# EAGLE design shield (EAGLE 6.6.0)

## Sheet 1 of 4
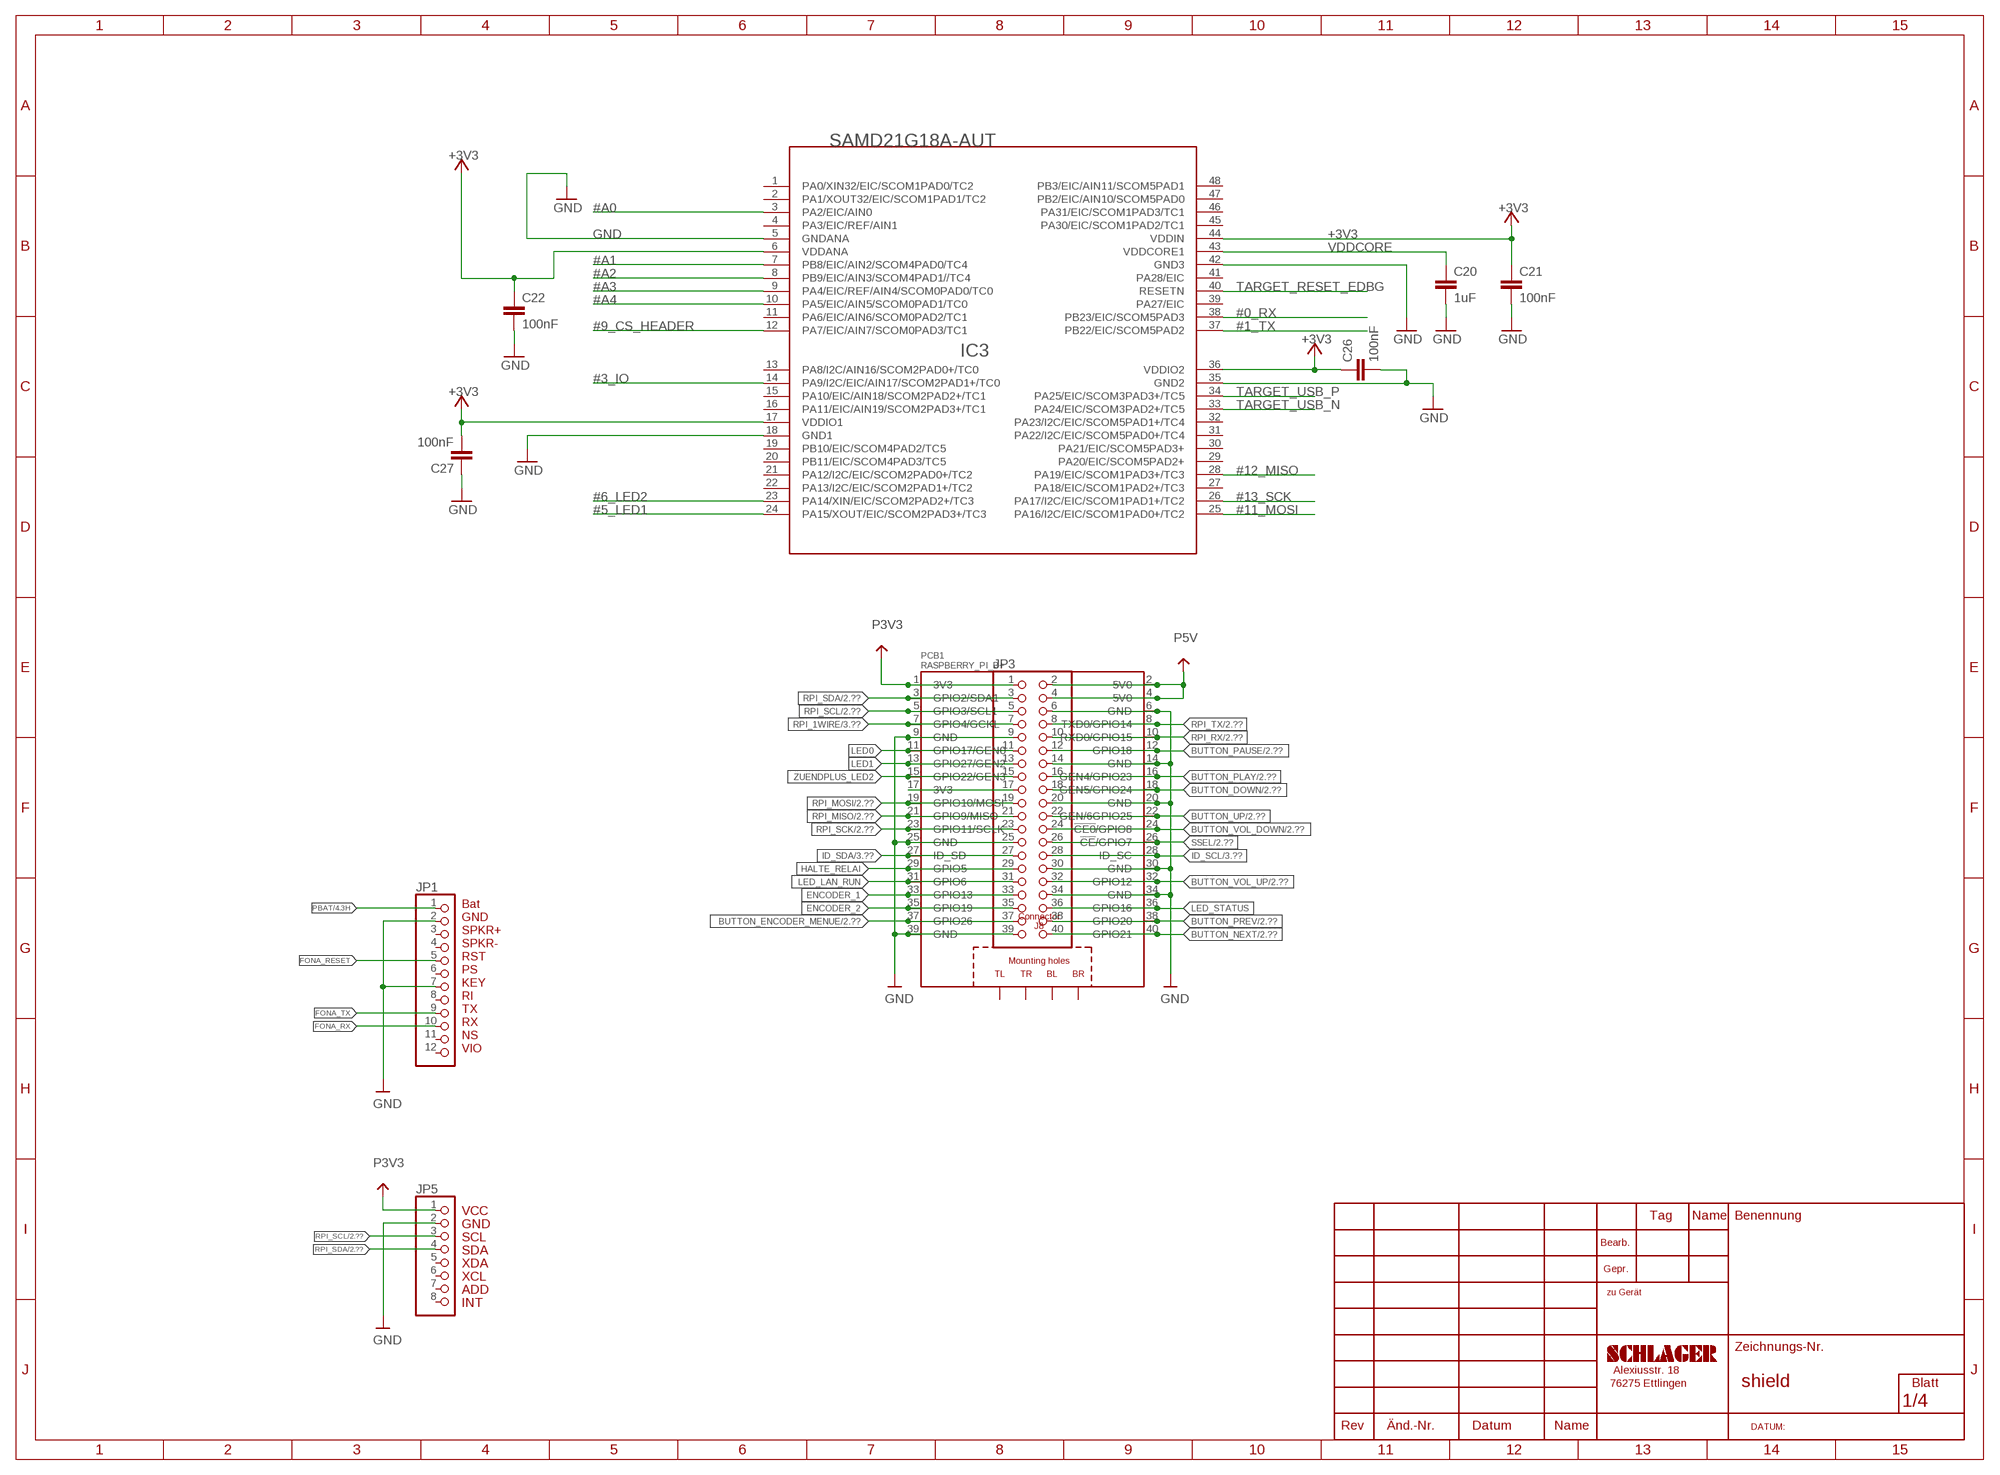
[diagram p0: schematic, sheet 1]

### Parts
C20  1uF  C-EUC0805  [C0805]
C21  100nF  C-EUC0805  [C0805]
C22  100nF  C-EUC0805  [C0805]
C26  100nF  C-EUC0805  [C0805]
C27  100nF  C-EUC0805  [C0805]
IC3  SAMD21G18A-AUT  1792_SAMD21G18A-AUT  [TQFP48-7X7]
JP1  ADAFRUIT-FONA  [ADAFRUITFONA]
JP3  PINHD-2X20  [2X20]
JP5  GY-521  [GY-521]
PCB1  RASPBERRY_PI_B+  [RASPBERRY_PI_B+]

### Nets
3V3@2: JP3.17 PCB1.17(3V3)
#0_RX: IC3.38(PB23/EIC/SCOM5PAD3)
#1_TX: IC3.37(PB22/EIC/SCOM5PAD2)
#3_IO: IC3.14(PA9/I2C/EIC/AIN17/SCOM2PAD1+/TC0)
#5_LED1: IC3.24(PA15/XOUT/EIC/SCOM2PAD3+/TC3)
#6_LED2: IC3.23(PA14/XIN/EIC/SCOM2PAD2+/TC3)
#9_CS_HEADER: IC3.12(PA7/EIC/AIN7/SCOM0PAD3/TC1)
#11_MOSI: IC3.25(PA16/I2C/EIC/SCOM1PAD0+/TC2)
#12_MISO: IC3.28(PA19/EIC/SCOM1PAD3+/TC3)
#13_SCK: IC3.26(PA17/I2C/EIC/SCOM1PAD1+/TC2)
#A0: IC3.3(PA2/EIC/AIN0)
#A1: IC3.7(PB8/EIC/AIN2/SCOM4PAD0/TC4)
#A2: IC3.8(PB9/EIC/AIN3/SCOM4PAD1//TC4)
#A3: IC3.9(PA4/EIC/REF/AIN4/SCOM0PAD0/TC0)
#A4: IC3.10(PA5/EIC/AIN5/SCOM0PAD1/TC0)
+3V3: C21.1 C22.1 C26.1 C27.2 IC3.6(VDDANA) IC3.17(VDDIO1) IC3.36(VDDIO2) IC3.44(VDDIN) ; also sheet 4
BUTTON_DOWN: JP3.18 PCB1.18(GEN5/GPIO24) ; also sheet 2
BUTTON_ENCODER_MENUE: JP3.37 PCB1.37(GPIO26) ; also sheet 2
BUTTON_NEXT: JP3.40 PCB1.40(GPIO21) ; also sheet 2
BUTTON_PAUSE: JP3.12 PCB1.12(GPIO18) ; also sheet 2
BUTTON_PLAY: JP3.16 PCB1.16(GEN4/GPIO23) ; also sheet 2
BUTTON_PREV: JP3.38 PCB1.38(GPIO20) ; also sheet 2
BUTTON_UP: JP3.22 PCB1.22(GEN/6GPIO25) ; also sheet 2
BUTTON_VOL_DOWN: JP3.24 PCB1.24(!CE0!/GPIO8) ; also sheet 2
BUTTON_VOL_UP: JP3.32 PCB1.32(GPIO12) ; also sheet 2
ENCODER_1: JP3.33 PCB1.33(GPIO13)
ENCODER_2: JP3.35 PCB1.35(GPIO19)
FONA_RESET: JP1.5
FONA_RX: JP1.10
FONA_TX: JP1.9
GND: C20.2 C21.2 C22.2 C26.2 C27.1 IC3.5(GNDANA) IC3.18(GND1) IC3.35(GND2) IC3.42(GND3) JP1.2 JP1.7 JP3.6 JP3.14 JP3.20 JP3.30 JP3.34 JP5.2 PCB1.6(GND) PCB1.14(GND) PCB1.20(GND) PCB1.30(GND) PCB1.34(GND) ; also sheet 2,3,4
GND@1: JP3.9 JP3.25 JP3.39 PCB1.9(GND) PCB1.25(GND) PCB1.39(GND) ; supply symbol labelled GND
HALTE_RELAI: JP3.29 PCB1.29(GPIO5)
ID_SCL: JP3.28 PCB1.28(ID_SC) ; also sheet 3
ID_SDA: JP3.27 PCB1.27(ID_SD) ; also sheet 3
LED0: JP3.11 PCB1.11(GPIO17/GEN0)
LED1: JP3.13 PCB1.13(GPIO27/GEN2)
LED_LAN_RUN: JP3.31 PCB1.31(GPIO6)
LED_STATUS: JP3.36 PCB1.36(GPIO16)
P3V3: JP3.1 JP5.1 PCB1.1(3V3) ; also sheet 2,3,4
P5V: JP3.2 JP3.4 PCB1.2(5V0) PCB1.4(5V0) ; also sheet 3
PBAT: JP1.1 ; also sheet 4
RPI_1WIRE: JP3.7 PCB1.7(GPIO4/GCKL) ; also sheet 3
RPI_MISO: JP3.21 PCB1.21(GPIO9/MISO) ; also sheet 2
RPI_MOSI: JP3.19 PCB1.19(GPIO10/MOSI) ; also sheet 2
RPI_RX: JP3.10 PCB1.10(RXD0/GPIO15) ; also sheet 2
RPI_SCK: JP3.23 PCB1.23(GPIO11/SCLK) ; also sheet 2
RPI_SCL: JP3.5 JP5.3 PCB1.5(GPIO3/SCL1) ; also sheet 2,3
RPI_SDA: JP3.3 JP5.4 PCB1.3(GPIO2/SDA1) ; also sheet 2,3
RPI_TX: JP3.8 PCB1.8(TXD0/GPIO14) ; also sheet 2
SSEL: JP3.26 PCB1.26(!CE!/GPIO7) ; also sheet 2
TARGET_RESET_EDBG: IC3.40(RESETN)
TARGET_USB_N [USBpair]: IC3.33(PA24/EIC/SCOM3PAD2+/TC5) ; also sheet 2
TARGET_USB_P [USBpair]: IC3.34(PA25/EIC/SCOM3PAD3+/TC5) ; also sheet 2
VDDCORE: C20.1 IC3.43(VDDCORE1)
ZUENDPLUS_LED2: JP3.15 PCB1.15(GPIO22/GEN3)
Unconnected: IC3.1(PA0/XIN32/EIC/SCOM1PAD0/TC2) IC3.2(PA1/XOUT32/EIC/SCOM1PAD1/TC2) IC3.4(PA3/EIC/REF/AIN1) IC3.11(PA6/EIC/AIN6/SCOM0PAD2/TC1) IC3.13(PA8/I2C/AIN16/SCOM2PAD0+/TC0) IC3.15(PA10/EIC/AIN18/SCOM2PAD2+/TC1) IC3.16(PA11/EIC/AIN19/SCOM2PAD3+/TC1) IC3.19(PB10/EIC/SCOM4PAD2/TC5) IC3.20(PB11/EIC/SCOM4PAD3/TC5) IC3.21(PA12/I2C/EIC/SCOM2PAD0+/TC2) IC3.22(PA13/I2C/EIC/SCOM2PAD1+/TC2) IC3.27(PA18/EIC/SCOM1PAD2+/TC3) IC3.29(PA20/EIC/SCOM5PAD2+) IC3.30(PA21/EIC/SCOM5PAD3+) IC3.31(PA22/I2C/EIC/SCOM5PAD0+/TC4) IC3.32(PA23/I2C/EIC/SCOM5PAD1+/TC4) IC3.39(PA27/EIC) IC3.41(PA28/EIC) IC3.45(PA30/EIC/SCOM1PAD2/TC1) IC3.46(PA31/EIC/SCOM1PAD3/TC1) IC3.47(PB2/EIC/AIN10/SCOM5PAD0) IC3.48(PB3/EIC/AIN11/SCOM5PAD1) JP1.3 JP1.4 JP1.6 JP1.8 JP1.11 JP1.12 JP5.5 JP5.6 JP5.7 JP5.8 PCB1.PE_BL(BL) PCB1.PE_BR(BR) PCB1.PE_TL(TL) PCB1.PE_TR(TR)

## Sheet 2 of 4
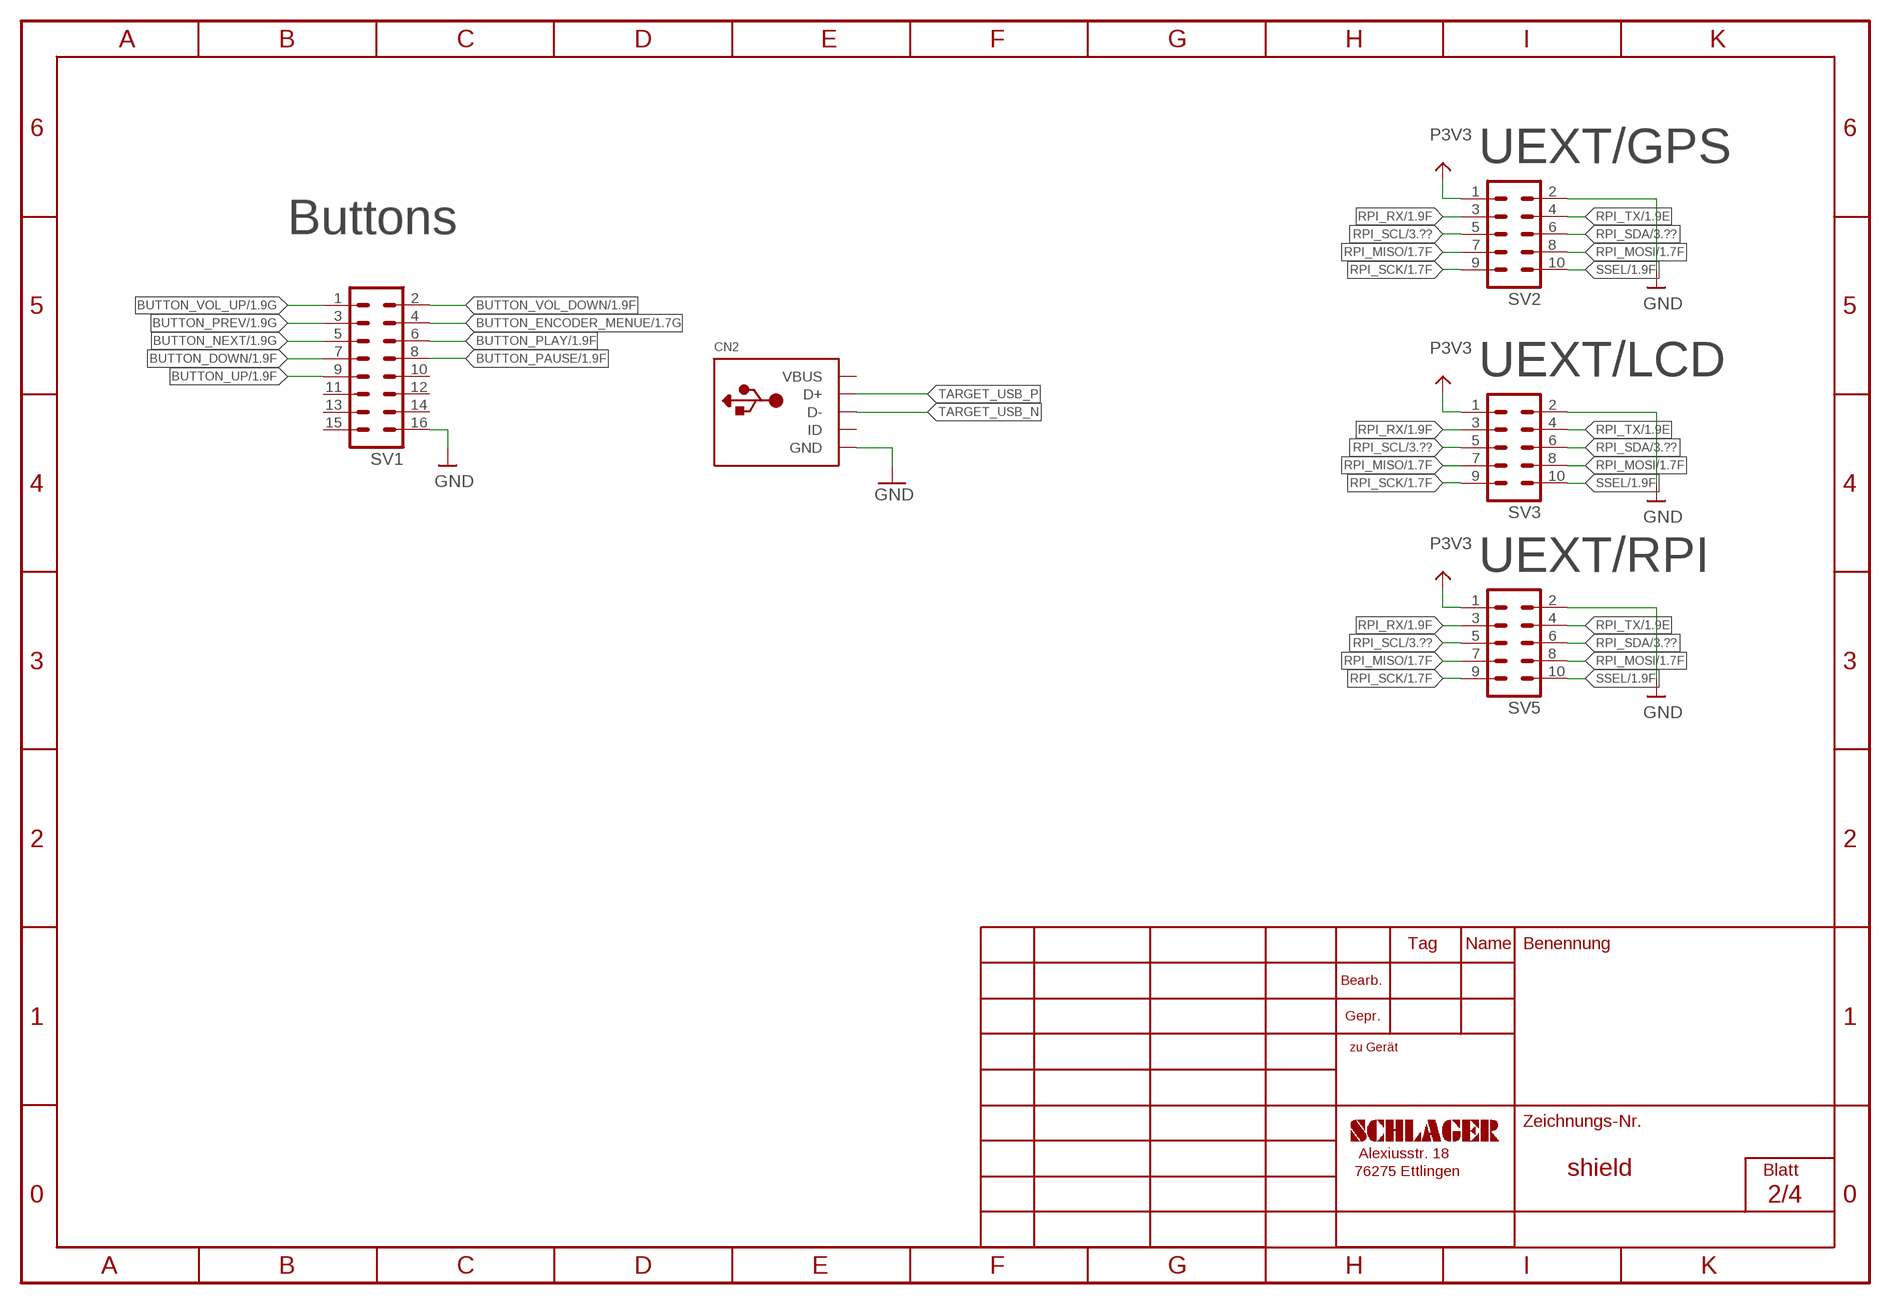
[diagram p1: schematic, sheet 2]

### Parts
CN2  USBMINIB  [USB-MINIB]
SV1  ML16  [ML16]
SV2  ML10  [ML10]
SV3  ML10  [ML10]
SV5  ML10  [ML10]

### Nets
BUTTON_DOWN: SV1.7 ; also sheet 1
BUTTON_ENCODER_MENUE: SV1.4 ; also sheet 1
BUTTON_NEXT: SV1.5 ; also sheet 1
BUTTON_PAUSE: SV1.8 ; also sheet 1
BUTTON_PLAY: SV1.6 ; also sheet 1
BUTTON_PREV: SV1.3 ; also sheet 1
BUTTON_UP: SV1.9 ; also sheet 1
BUTTON_VOL_DOWN: SV1.2 ; also sheet 1
BUTTON_VOL_UP: SV1.1 ; also sheet 1
GND: CN2.GND SV1.16 SV2.2 SV3.2 SV5.2 ; also sheet 1,3,4
P3V3: SV2.1 SV3.1 SV5.1 ; also sheet 1,3,4
RPI_MISO: SV2.7 SV3.7 SV5.7 ; also sheet 1
RPI_MOSI: SV2.8 SV3.8 SV5.8 ; also sheet 1
RPI_RX: SV2.3 SV3.3 SV5.3 ; also sheet 1
RPI_SCK: SV2.9 SV3.9 SV5.9 ; also sheet 1
RPI_SCL: SV2.5 SV3.5 SV5.5 ; also sheet 1,3
RPI_SDA: SV2.6 SV3.6 SV5.6 ; also sheet 1,3
RPI_TX: SV2.4 SV3.4 SV5.4 ; also sheet 1
SSEL: SV2.10 SV3.10 SV5.10 ; also sheet 1
TARGET_USB_N [USBpair]: CN2.D- ; also sheet 1
TARGET_USB_P [USBpair]: CN2.D+ ; also sheet 1
Unconnected: CN2.ID SV1.10 SV1.11 SV1.12 SV1.13 SV1.14 SV1.15

### Notes on the sheet
- UEXT/GPS
- Buttons
- UEXT/LCD
- UEXT/RPI

## Sheet 3 of 4: 1wire
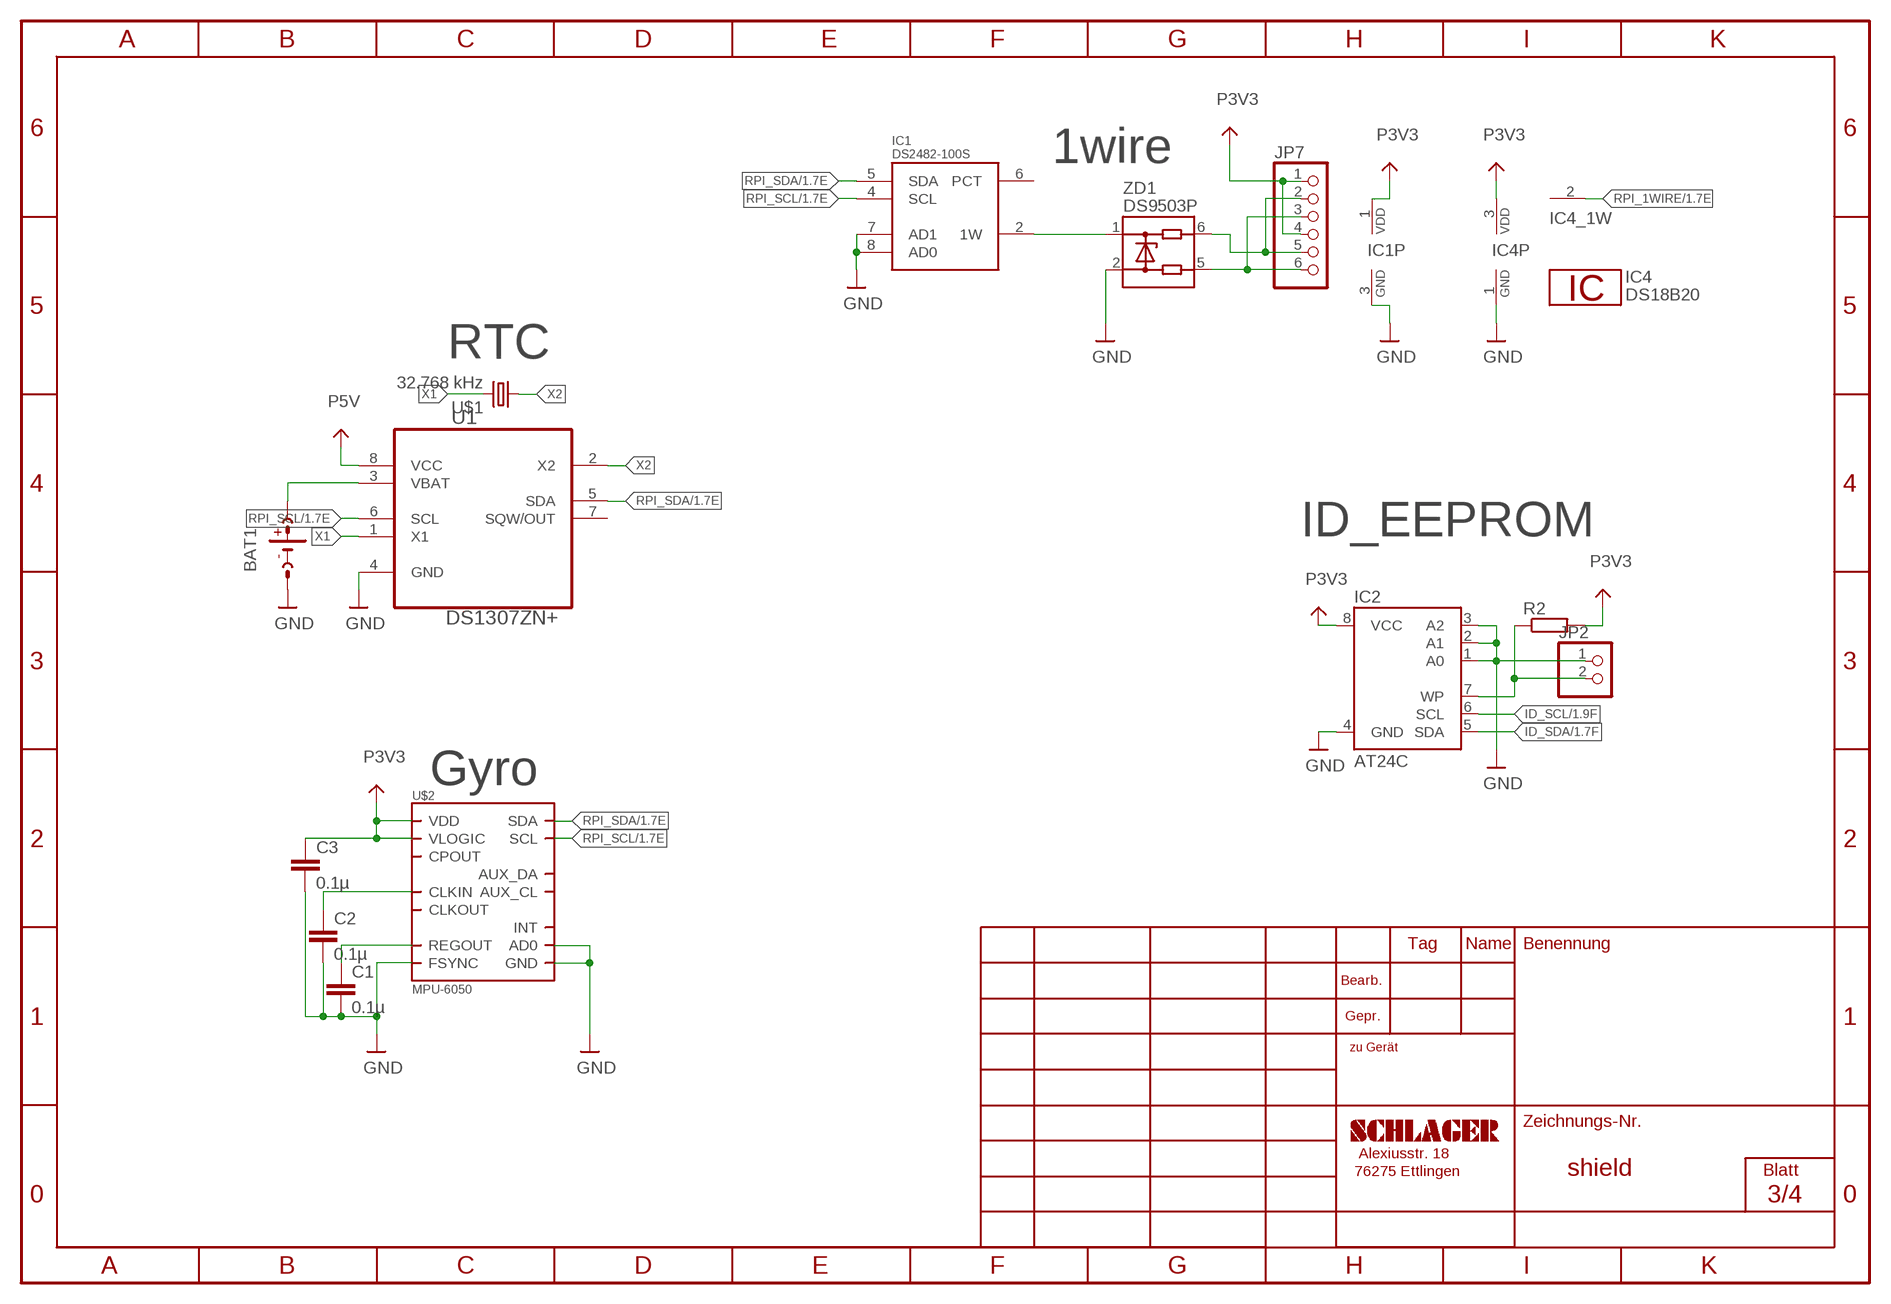
[diagram p2: schematic, sheet 3]

### Parts
BAT1  CR2032  [CR2032-SOCKET]
C1  0.1µ  C-EUC0805  [C0805]
C2  0.1µ  C-EUC0805  [C0805]
C3  0.1µ  C-EUC0805  [C0805]
IC1  DS2482-100S  [SO08]
IC2  AT24C  [SO08]
IC4  DS18B20  [TO92-]
JP2  PINHD-1X2  [1X02]
JP7  PINHD-1X6/90  [1X06/90]
R2  R-EU_R0805  [R0805]
U1  DS1307ZN+  [SOIC127P600X175-8N]
U$1  32.768 kHz  CC5V-12,5  [CC5]
U$2  MPU-6050  [QFN.24.4X4]
ZD1  DS9503P  [TSOC6]

### Nets
GND: BAT1.M(NEG) C1.2 C2.2 C3.2 IC1.3(GND) IC1.7(AD1) IC1.8(AD0) IC2.1(A0) IC2.2(A1) IC2.3(A2) IC2.4(GND) IC4.1 JP2.1 U1.4(GND) U$2.9(AD0) U$2.11(FSYNC) U$2.18(GND) ZD1.2 ; also sheet 1,2,4
ID_SCL: IC2.6(SCL) ; also sheet 1
ID_SDA: IC2.5(SDA) ; also sheet 1
N$1: BAT1.P(POS2) U1.3(VBAT)
N$2: JP7.3 JP7.6 ZD1.5
N$3: C1.1 U$2.10(REGOUT)
N$4: C2.1 U$2.1(CLKIN)
N$5: IC2.7(WP) JP2.2 R2.1
N$6: JP7.2 JP7.5 ZD1.6
N$10: IC1.2(1W) ZD1.1
P3V3: C3.1 IC1.1(VDD) IC2.8(VCC) IC4.3 JP7.1 JP7.4 R2.2 U$2.8(VLOGIC) U$2.13(VDD) ; also sheet 1,2,4
P5V: U1.8(VCC) ; also sheet 1
RPI_1WIRE: IC4.2 ; also sheet 1
RPI_SCL: IC1.4(SCL) U1.6(SCL) U$2.23(SCL) ; also sheet 1,2
RPI_SDA: IC1.5(SDA) U1.5(SDA) U$2.24(SDA) ; also sheet 1,2
X1: U1.1(X1) U$1.P$2
X2: U1.2(X2) U$1.P$1
Unconnected: IC1.6(PCT) U1.7(SQW/OUT) U$2.6(AUX_DA) U$2.7(AUX_CL) U$2.12(INT) U$2.20(CPOUT) U$2.22(CLKOUT)

### Notes on the sheet
- 1wire
- RTC
- ID_EEPROM
- Gyro

## Sheet 4 of 4
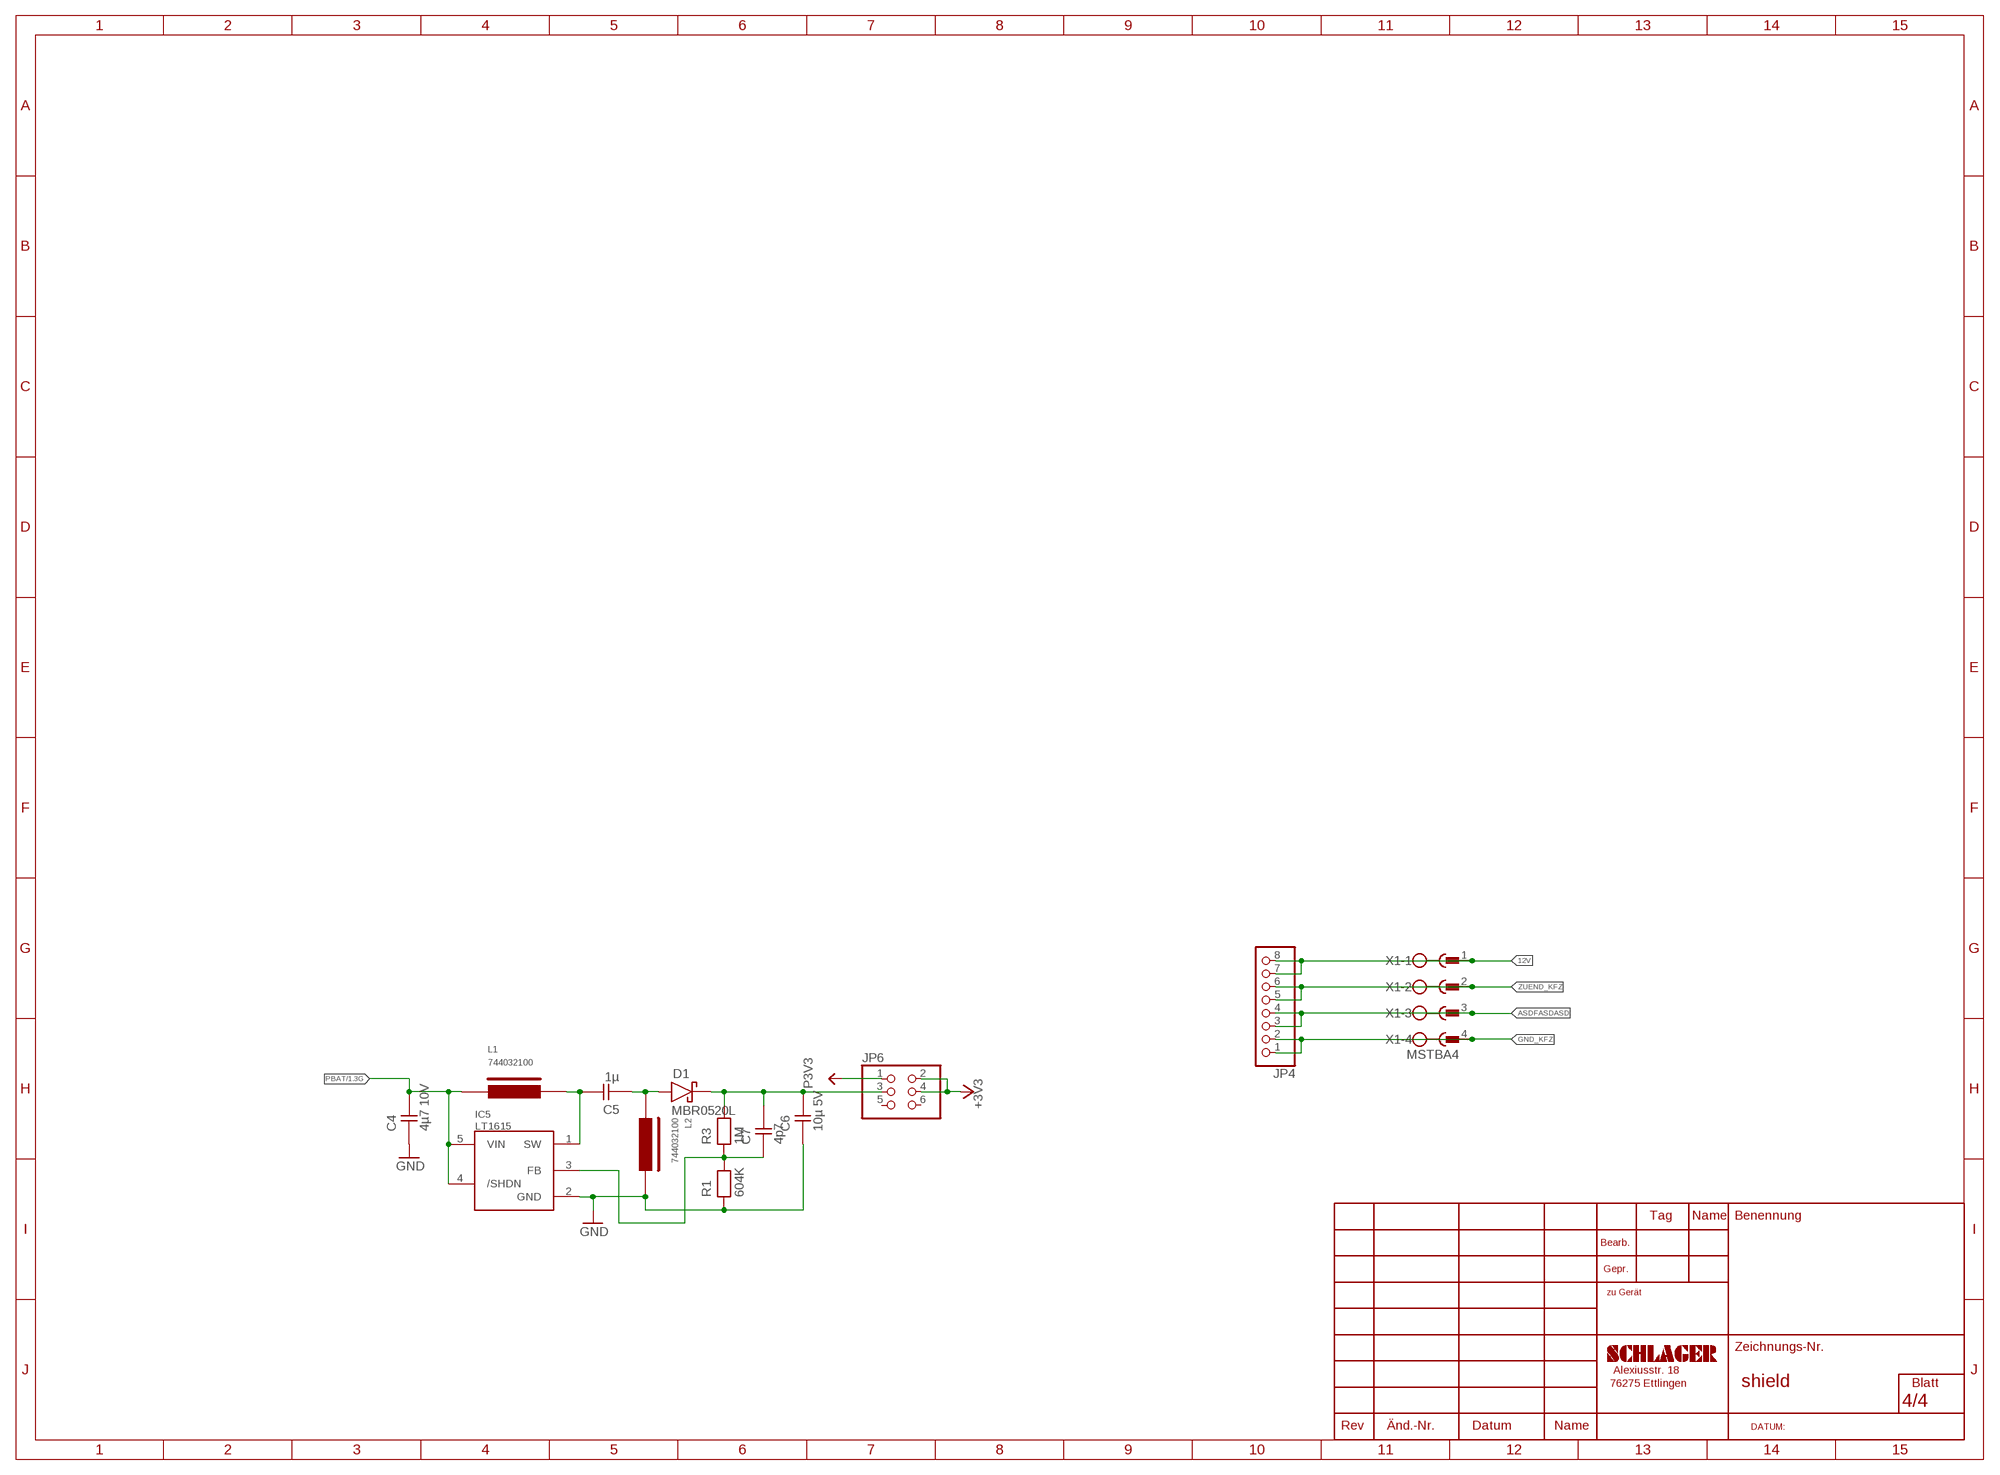
[diagram p3: schematic, sheet 4]

### Parts
C4  4µ7 10V  CAP0805  [0805]
C5  1µ  CAP0805  [0805]
C6  10µ 5V  CAP0805  [0805]
C7  4p7  CAP0603R  [0603REFLOW]
D1  MBR0520L  [SOD123]
IC5  LT1615  [SOT23-5]
JP4  PINHD-1X8/90  [1X08/90]
JP6  PINHD-2X3  [2X03]
L1  744032100  WE-LQ  [WE-LQ]
L2  744032100  WE-LQ  [WE-LQ]
R1  604K  RES0603R  [0603REFLOW]
R3  1M  RES0603R  [0603REFLOW]
X1  MSTBA4  [MSTBA4]

### Nets
12V: JP4.7 JP4.8 X1.1
+3V3: JP6.2 JP6.4 ; also sheet 1
ASDFASDASD: JP4.3 JP4.4 X1.3
GND: C4.1 C6.1 IC5.2(GND) L2.P$2 R1.1 ; also sheet 1,2,3
GND_KFZ: JP4.1 JP4.2 X1.4
N$7: C5.2 IC5.1(SW) L1.P$2
N$8: C5.1 D1.A L2.P$1
N$9: C6.2 C7.2 D1.K JP6.3 R3.2
N$16: C7.1 IC5.3(FB) R1.2 R3.1
P3V3: JP6.1 ; also sheet 1,2,3
PBAT: C4.2 IC5.4(/SHDN) IC5.5(VIN) L1.P$1 ; also sheet 1
ZUEND_KFZ: JP4.5 JP4.6 X1.2
Unconnected: JP6.5 JP6.6

## Power pins joined to a net without a drawn wire
VBUS: CN2.VBUS

## Library data of the parts
BAT1 = con_bat_2032__s_:CR2032
C1-C3 C20-C22 C26 C27 = schlager_passiv:C-EU: CAPACITOR, European symbol
C4-C6 = MYPASS:CAP0805
C7 = mypassive-bleifrei:CAP0603
CN2 = adafruit:USB: USB Connectors USBMINIB - Surface Mount Female Mini-B USB Connector 4UConnector: 06564 By microbuilder.eu Thru-hole RA Female Mini-B USB Connector 4UConnector: 18732 By ladyada.net
D1 = MYDISCR:MBR0520L
IC1 = 1wire:DS2482-100: I2C to 1-Wire Host Adapter/Line Driver This device is a onewire host and I2C interface in one chip. It provides the complete DC/AC requirements for onewire communication, including overdrive speed mode, but, unlike the DS2480B chip, no 12V EPROM programming. Notes: For overdrive speed and 5V EEPROM programming, an external active pullup circuit must be connected to the 1W, VDD and PCT pin. See the datasheet for details. The lower two I2C adress bits of the chip can be selected by external pins, so up to 4 chips may be connected to the same I2C bus. Author: Orginal device and description from Giovanni Varasano <giovanni.varasano@fastwebnet.it> Improved by Jan Kandziora <jjj@gmx.de>
IC2 = schlager_ics:AT24C*: 2-wire serial EEPROM
IC3 = IntegratedCircuits:1792_SAMD21G18A-AUT: Atmel D21 32bit ARM Cortex-M0 microcontroller - 48 PIN TQFP 256KB flash memory + 32KB SRAM
IC4 = 1wire:DS18B20: Programmable Resolution Digital Thermometer This chip provides a onewire thermosensor with approx. 0.5°C accuracy. A programmable over/undertemperure alarm is available. The precision can be set from 9..12 bits. Notes: Vdd must be applied for accurate measurements at low temperatures, as the parasite power circuit otherwise heats the sensor. If parasite power is used, Vdd has to be connected to GND. The DS1822 is a low-cost thermometer chip, the DS18S20 is similar to the DS18B20, but with 9 Bit precision only. Author: Jan Kandziora <jjj@gmx.de>
IC5 = MYLT:LT1615
JP1 = schlager_modules:ADAFRUIT-FONA: PIN HEADER
JP2 = pinhead:PINHD-1X2: PIN HEADER
JP3 = pinhead:PINHD-2X20: PIN HEADER
JP4 = pinhead:PINHD-1X8: PIN HEADER
JP5 = schlager_modules:GY-521: PIN HEADER
JP6 = pinhead:PINHD-2X3: PIN HEADER
JP7 = pinhead:PINHD-1X6: PIN HEADER
L1 L2 = myinductiv:WE-LQ
PCB1 = RASPBERRY_PI_Bplus:RASPBERRY_PI_B+: Raspberry Pi B+ Based on issue: Thursday, July 10, 2014 - Rev 1.2 LBR by Tim R. 07-2014
R1 R3 = mypassive-bleifrei:RES0603
R2 = schlager_passiv:R-EU_: RESISTOR, European symbol
SV1 = X_Pfostenstecker:ML16: HARTING; OC_FARNELL: unknown; OC_NEWARK: unknown
SV2 SV3 SV5 = X_Pfostenstecker:ML10: HARTING; OC_FARNELL: unknown; OC_NEWARK: unknown
U1 = schlager_ics:DS1307ZN+: 64 x 8, Serial, I2C Real-Time Clock; MPN: DS1307ZN+; OC_FARNELL: 9725253; OC_NEWARK: 96K8872; PACKAGE: SOIC-8; SUPPLIER: Maxim
U$1 = schlager_Quarze:CC5V; MPN: CC5V-T1A 32,768KHZ 12,5PF; OC_FARNELL: 1539374RL; OC_REICHELT: 32,768 CC5V-12,5
U$2 = invensense:MPU-6050
X1 = X_Phoenix:MSTBA4: PHOENIX
ZD1 = 1wire:DS9503: ESD Protection Diode with Resistors This ESD protection diode is designed especially for onewire host interfaces. Unlike the DS9502, it has two additional 5Ohm resitors in the 1W and GND line. Pin 5 and 6 have to be connected to the host side, pin 1 und 2 to the network side. The 1W line is through pin 1 and 6, the GND line is through pin 2 and 5. Author: Jan Kandziora <jjj@gmx.de>

## Net classes
4 USBpair: width 0.254 mm, drill 0.406 mm, clearance 0.508 mm

## Board
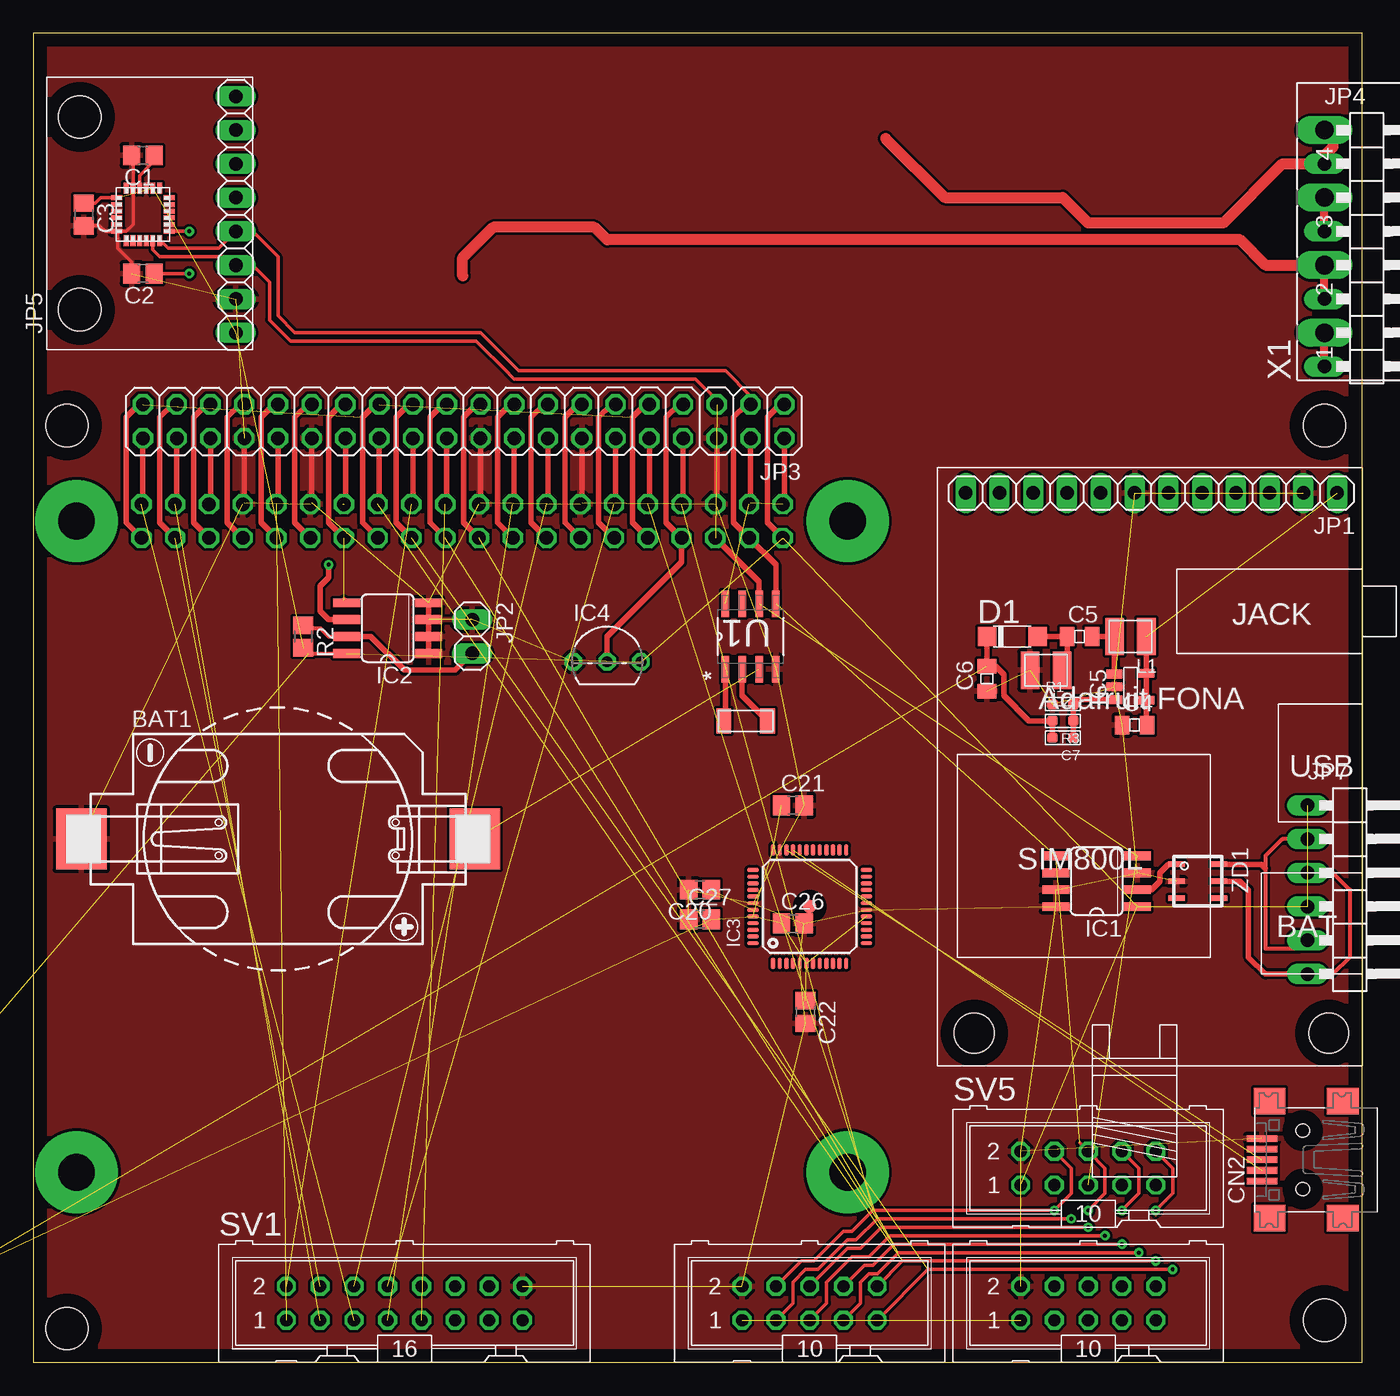
[diagram p4: board, top side]
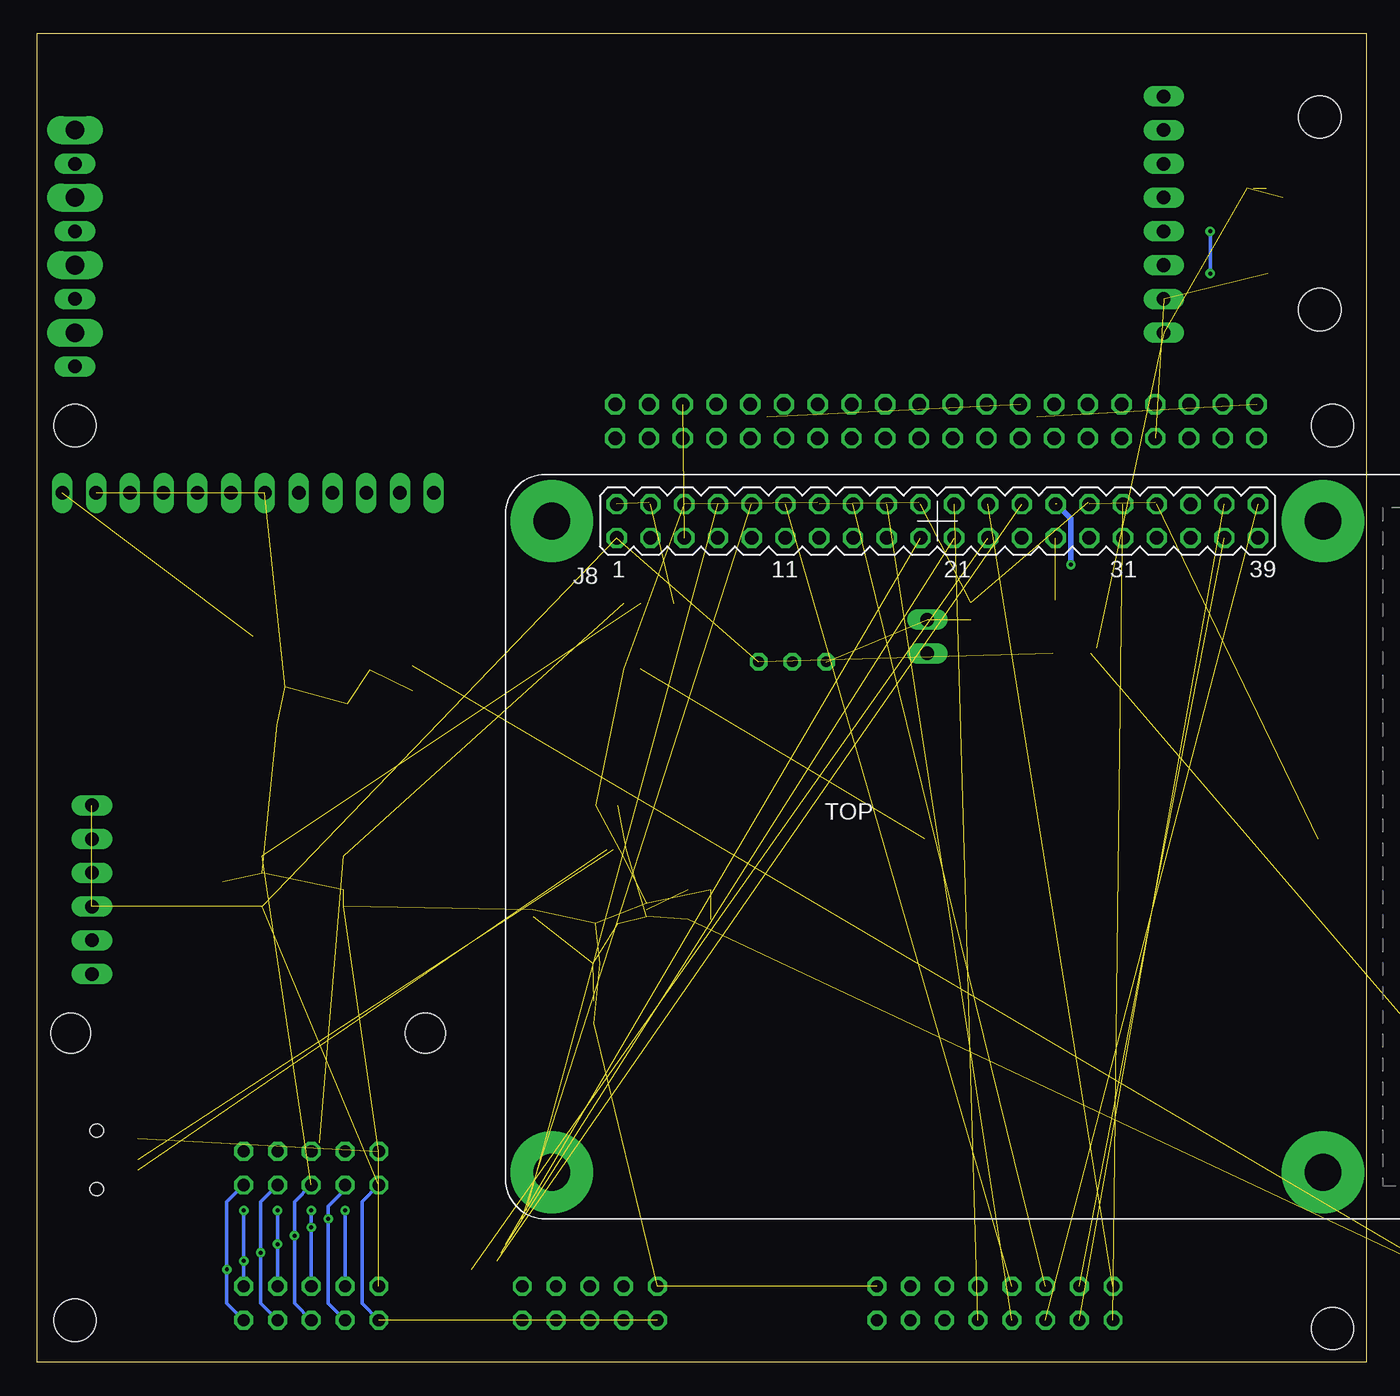
[diagram p5: board, bottom side, seen from below]

Size 100 x 100 mm. Coordinates in mm from the lower left corner, seen from the top.
Outline: 0,0 100,0 100,100 0,100 0,0
Copper layers (1*16): Top 0.035mm / dielectric 1.5mm / Bottom 0.035mm
Design rules "default": minimum track width 10mil, minimum drill 24mil, track to track 8mil, track to pad 8mil, pad to pad 8mil, via to via 8mil, smd to smd 8mil, copper to edge 40mil, drill to drill 8mil, minimum pad ring 10mil, minimum via ring 8mil, stop-mask expansion 4mil, vias tented up to drill 0mil, thermal gap 10mil
Holes 3.2 mm at 2.54,70.48 2.54,2.54 97.16,70.48 97.16,3.17

### Footprints (pad centres in the part's own frame; a part is rotated, then mirrored left to right if it is on the bottom)
CR2032-SOCKET = smd 3.8 x 4.6: M -14.8,0; P 14.8,0
C0805 = smd 1.3 x 1.5: 1 -0.85,0; 2 0.85,0
0805 = smd 1.092 x 1.397: 1 -0.94,0; 2 0.94,0
0603REFLOW = smd 0.8 x 0.75: 1 -0.8,0; 2 0.8,0
USB-MINIB = smd 0.5 x 2.308: D+ 0,4.064; D- -0.8,4.064; GND 1.6,4.064; ID 0.8,4.064; VBUS -1.6,4.064 | smd 2 x 2.4: GND1 -4.4,-2; GND2 -4.4,3.5; GND3 4.4,3.5; GND4 4.4,-2 | hole 1: -2.2,1; 2.2,1
SOD123 = smd 1.4 x 1.4: A 1.9,0; K -1.9,0
SO08 = smd 0.66 x 2.032: 1 -1.905,-3.073; 2 -0.635,-3.073; 3 0.635,-3.073; 4 1.905,-3.073; 5 1.905,3.073; 6 0.635,3.073; 7 -0.635,3.073; 8 -1.905,3.073
TQFP48-7X7 = smd 0.85 x 0.32: 1 -4.275,2.75; 2 -4.275,2.25; 3 -4.275,1.75; 4 -4.275,1.25; 5 -4.275,0.75; 6 -4.275,0.25; 7 -4.275,-0.25; 8 -4.275,-0.75; 9 -4.275,-1.25; 10 -4.275,-1.75; 11 -4.275,-2.25; 12 -4.275,-2.75; 25 4.275,-2.75; 26 4.275,-2.25; 27 4.275,-1.75; 28 4.275,-1.25; 29 4.275,-0.75; 30 4.275,-0.25; 31 4.275,0.25; 32 4.275,0.75; 33 4.275,1.25; 34 4.275,1.75; 35 4.275,2.25; 36 4.275,2.75 | smd 0.32 x 0.85: 13 -2.75,-4.275; 14 -2.25,-4.275; 15 -1.75,-4.275; 16 -1.25,-4.275; 17 -0.75,-4.275; 18 -0.25,-4.275; 19 0.25,-4.275; 20 0.75,-4.275; 21 1.25,-4.275; 22 1.75,-4.275; 23 2.25,-4.275; 24 2.75,-4.275; 37 2.75,4.275; 38 2.25,4.275; 39 1.75,4.275; 40 1.25,4.275; 41 0.75,4.275; 42 0.25,4.275; 43 -0.25,4.275; 44 -0.75,4.275; 45 -1.25,4.275; 46 -1.75,4.275; 47 -2.25,4.275; 48 -2.75,4.275 | smd 1 x 1: P$1 0,0
TO92- = drill 0.813 octagon: 1 -2.54,0; 2 0,0; 3 2.54,0
SOT23-5 = smd 0.65 x 1.2: 1 0.991,1.216; 2 0.025,1.216; 3 -0.94,1.216; 4 -0.991,-1.216; 5 1.041,-1.216
ADAFRUITFONA = drill 1.016 long: 1 1.905,1.905; 2 4.445,1.905; 3 6.985,1.905; 4 9.525,1.905; 5 12.065,1.905; 6 14.605,1.905; 7 17.145,1.905; 8 19.685,1.905; 9 22.225,1.905; 10 24.765,1.905; 11 27.305,1.905; 12 29.845,1.905 | hole 3: 2.54,42.545; 29.21,42.545
1X02 = drill 1.016 long: 1 -1.27,0; 2 1.27,0
2X20 = drill 1.016 octagon: 1 -24.13,-1.27; 2 -24.13,1.27; 3 -21.59,-1.27; 4 -21.59,1.27; 5 -19.05,-1.27; 6 -19.05,1.27; 7 -16.51,-1.27; 8 -16.51,1.27; 9 -13.97,-1.27; 10 -13.97,1.27; 11 -11.43,-1.27; 12 -11.43,1.27; 13 -8.89,-1.27; 14 -8.89,1.27; 15 -6.35,-1.27; 16 -6.35,1.27; 17 -3.81,-1.27; 18 -3.81,1.27; 19 -1.27,-1.27; 20 -1.27,1.27; 21 1.27,-1.27; 22 1.27,1.27; 23 3.81,-1.27; 24 3.81,1.27; 25 6.35,-1.27; 26 6.35,1.27; 27 8.89,-1.27; 28 8.89,1.27; 29 11.43,-1.27; 30 11.43,1.27; 31 13.97,-1.27; 32 13.97,1.27; 33 16.51,-1.27; 34 16.51,1.27; 35 19.05,-1.27; 36 19.05,1.27; 37 21.59,-1.27; 38 21.59,1.27; 39 24.13,-1.27; 40 24.13,1.27
1X08/90 = drill 1.016 long: 1 -8.89,-3.81; 2 -6.35,-3.81; 3 -3.81,-3.81; 4 -1.27,-3.81; 5 1.27,-3.81; 6 3.81,-3.81; 7 6.35,-3.81; 8 8.89,-3.81
GY-521 = drill 1.016 long: 1 1.27,1.27; 2 3.81,1.27; 3 6.35,1.27; 4 8.89,1.27; 5 11.43,1.27; 6 13.97,1.27; 7 16.51,1.27; 8 19.05,1.27 | hole 3.2: 3,13; 17.5,13
2X03 = drill 1.016 octagon: 1 -2.54,-1.27; 2 -2.54,1.27; 3 0,-1.27; 4 0,1.27; 5 2.54,-1.27; 6 2.54,1.27
1X06/90 = drill 1.016 long: 1 -6.35,-3.81; 2 -3.81,-3.81; 3 -1.27,-3.81; 4 1.27,-3.81; 5 3.81,-3.81; 6 6.35,-3.81
WE-LQ = smd 1.4 x 2.8: P$1 -1.2,0; P$2 1.2,0
RASPBERRY_PI_B+ = drill 1.016 octagon: 1 8.37,51.23; 2 8.37,53.77; 3 10.91,51.23; 4 10.91,53.77; 5 13.45,51.23; 6 13.45,53.77; 7 15.99,51.23; 8 15.99,53.77; 9 18.53,51.23; 10 18.53,53.77; 11 21.07,51.23; 12 21.07,53.77; 13 23.61,51.23; 14 23.61,53.77; 15 26.15,51.23; 16 26.15,53.77; 17 28.69,51.23; 18 28.69,53.77; 19 31.23,51.23; 20 31.23,53.77; 21 33.77,51.23; 22 33.77,53.77; 23 36.31,51.23; 24 36.31,53.77; 25 38.85,51.23; 26 38.85,53.77; 27 41.39,51.23; 28 41.39,53.77; 29 43.93,51.23; 30 43.93,53.77; 31 46.47,51.23; 32 46.47,53.77; 33 49.01,51.23; 34 49.01,53.77; 35 51.55,51.23; 36 51.55,53.77; 37 54.09,51.23; 38 54.09,53.77; 39 56.63,51.23; 40 56.63,53.77 | drill 2.75 pad 6.2: PE_BL 3.5,3.5; PE_BR 61.5,3.5; PE_TL 3.5,52.5; PE_TR 61.5,52.5
R0805 = smd 1.3 x 1.5: 1 -0.85,0; 2 0.85,0
ML16 = drill 0.914 octagon: 1 -8.89,-1.27; 2 -8.89,1.27; 3 -6.35,-1.27; 4 -6.35,1.27; 5 -3.81,-1.27; 6 -3.81,1.27; 7 -1.27,-1.27; 8 -1.27,1.27; 9 1.27,-1.27; 10 1.27,1.27; 11 3.81,-1.27; 12 3.81,1.27; 13 6.35,-1.27; 14 6.35,1.27; 15 8.89,-1.27; 16 8.89,1.27
ML10 = drill 0.914 octagon: 1 -5.08,-1.27; 2 -5.08,1.27; 3 -2.54,-1.27; 4 -2.54,1.27; 5 0,-1.27; 6 0,1.27; 7 2.54,-1.27; 8 2.54,1.27; 9 5.08,-1.27; 10 5.08,1.27
SOIC127P600X175-8N = smd 1.981 x 0.559: 1 -2.464,1.905; 2 -2.464,0.635; 3 -2.464,-0.635; 4 -2.464,-1.905; 5 2.464,-1.905; 6 2.464,-0.635; 7 2.464,0.635; 8 2.464,1.905
CC5 = smd 1.1 x 1.9: P$1 0,0; P$2 3.3,0
QFN.24.4X4 = smd 0.85 x 0.38: 1 -1.975,1.25; 2 -1.975,0.75; 3 -1.975,0.25; 4 -1.975,-0.25; 5 -1.975,-0.75; 6 -1.975,-1.25; 13 1.975,-1.25; 14 1.975,-0.75; 15 1.975,-0.25; 16 1.975,0.25; 17 1.975,0.75; 18 1.975,1.25 | smd 0.38 x 0.85: 7 -1.25,-1.975; 8 -0.75,-1.975; 9 -0.25,-1.975; 10 0.25,-1.975; 11 0.75,-1.975; 12 1.25,-1.975; 19 1.25,1.975; 20 0.75,1.975; 21 0.25,1.975; 22 -0.25,1.975; 23 -0.75,1.975; 24 -1.25,1.975
MSTBA4 = drill 1.397 long: 1 -7.62,5.08; 2 -2.54,5.08; 3 2.54,5.08; 4 7.62,5.08
TSOC6 = smd 0.406 x 1.219: 1 -1.27,-1.6; 2 0,-1.6; 3 1.27,-1.6; 4 1.27,1.6; 5 0,1.6; 6 -1.27,1.6

### Placement (x,y rotation side)
BAT1  18.41,39.37 0 top
C1  8.26,90.81 180 top
C2  8.26,81.92 180 top
C3  3.81,86.36 270 top
C4  82.87,47.94 0 top
C5  78.74,54.61 0 top
C6  71.75,51.44 90 top
C7  77.47,46.99 180 top
C20  50.16,35.56 180 top
C21  57.15,41.91 0 top
C22  58.1,26.35 270 top
C26  57.15,33.02 0 top
C27  50.16,33.34 0 top
CN2  96.52,15.24 90 top
D1  73.66,54.61 0 top
IC1  80.01,36.2 90 top
IC2  26.67,55.24 90 top
IC3  58.42,34.29 90 top
IC4  43.18,52.7 0 top
IC5  82.55,50.8 90 top
JP1  100.01,67.31 180 top
JP2  33.02,54.61 270 top
JP3  32.38,70.8 180 top
JP4  100.97,83.82 270 top
JP5  16.51,76.2 90 top
JP6  -27.94,-5.08 0 top  (outside the outline)
JP7  99.69,35.56 270 top
L1  82.55,54.61 180 top
L2  76.2,52.07 180 top
PCB1  64.77,10.79 0 bottom
R1  77.47,49.53 0 top
R2  20.32,54.61 270 top
R3  77.47,48.26 180 top
SV1  27.94,4.45 0 top
SV2  79.38,4.45 0 top
SV3  58.42,4.45 0 top
SV5  79.38,14.61 0 top
U1  53.98,54.61 90 top
U$1  55.24,48.26 180 top
U$2  8.26,86.36 180 top
X1  102.23,85.09 90 top
ZD1  87.63,36.2 270 top

### Tracks (layer width: path | path; a pad name or v marks a point on that pad's centre or on a via)
3V3@2
  Top 0.406: PCB1.17 34.92,63.18 34.92,71.12 35.88,72.07 JP3.17
12V
  Top 0.61: JP4.8 JP4.7
+3V3  (9 unrouted)
ASDFASDASD
  Top 0.61: JP4.4 JP4.3
BUTTON_DOWN  (1 unrouted)
  Top 0.406: JP3.18 36.2,64.68 PCB1.18
BUTTON_ENCODER_MENUE  (1 unrouted)
  Top 0.406: PCB1.37 9.53,63.18 9.53,71.12 10.48,72.07 JP3.37
BUTTON_NEXT  (1 unrouted)
  Top 0.406: JP3.40 8.26,64.68 PCB1.40
BUTTON_PAUSE  (1 unrouted)
  Top 0.406: JP3.12 43.81,64.68 PCB1.12
BUTTON_PLAY  (1 unrouted)
  Top 0.406: JP3.16 38.73,64.68 PCB1.16
BUTTON_PREV  (1 unrouted)
  Top 0.406: JP3.38 10.79,64.68 PCB1.38
BUTTON_UP  (1 unrouted)
  Top 0.406: JP3.22 31.11,64.68 PCB1.22
BUTTON_VOL_DOWN  (1 unrouted)
  Top 0.406: JP3.24 28.57,64.68 PCB1.24
BUTTON_VOL_UP  (1 unrouted)
  Top 0.406: JP3.32 18.41,64.68 PCB1.32
ENCODER_1
  Top 0.406: PCB1.33 14.61,63.18 14.61,71.12 15.56,72.07 JP3.33
ENCODER_2
  Top 0.406: PCB1.35 12.06,63.18 12.06,71.12 13.02,72.07 JP3.35
GND  (37 unrouted)
  Top 0.254: C1.2 7.5,90.7 U$2.11 7.5,85.61 6.99,85.09 6.3,85.09 U$2.18 | C2.2 7.41,82.77 6.35,83.82 6.35,85.04 U$2.18 | C3.2 4.98,85.51 5.4,85.09 6.26,85.09 U$2.18
  Top 0.406: JP3.6 51.44,64.68 PCB1.6 | JP3.14 41.27,64.68 PCB1.14 | JP3.20 33.66,64.68 PCB1.20 | JP3.30 20.95,64.68 PCB1.30 | JP3.34 15.88,64.68 PCB1.34 | IC2.1 IC2.2 IC2.3 IC2.4
  pour Top: -7.62,106.68 109.22,106.68 109.22,-8.89 -7.62,-10.16
GND@1  (2 unrouted)
  Top 0.406: PCB1.39 6.99,63.18 6.99,71.12 7.94,72.07 JP3.39 | PCB1.25 24.77,63.18 24.77,71.12 25.72,72.07 JP3.25 | PCB1.9 45.09,63.18 45.09,71.12 46.04,72.07 JP3.9
GND_KFZ
  Top 0.813: 64.14,92.08 68.58,87.63 77.47,87.63 79.38,85.72 89.53,85.72 93.98,90.17 96.52,90.17 | 96.52,90.17 JP4.2 97.79,90.17 | JP4.1 97.79,92.71 97.79,91.44 96.52,90.17
HALTE_RELAI
  Top 0.406: PCB1.29 19.68,63.18 19.68,71.12 20.64,72.07 JP3.29
ID_SCL  (via drill 0.3)  (1 unrouted)
  Top 0.406: JP3.28 23.5,64.68 PCB1.28 | IC2.6 22.23,55.88 21.59,56.52 21.59,58.42 22.23,59.05 v22.23,60.01
  Bottom 0.406: v22.23,60.01 22.23,63.5 23.29,64.56
ID_SDA  (1 unrouted)
  Top 0.406: PCB1.27 22.23,63.18 22.23,71.12 23.18,72.07 JP3.27 | IC2.5 23.38,57.37
LED0
  Top 0.406: PCB1.11 42.55,63.18 42.55,71.12 43.5,72.07 JP3.11
LED1
  Top 0.406: PCB1.13 40.01,63.18 40.01,71.12 40.96,72.07 JP3.13
LED_LAN_RUN
  Top 0.406: PCB1.31 17.14,63.18 17.14,71.12 18.1,72.07 JP3.31
LED_STATUS
  Top 0.406: JP3.36 13.34,64.68 PCB1.36
N$1  (1 unrouted)
N$2
  Top 0.305: JP7.3 97.79,36.83 99.06,35.56 99.06,30.48 97.79,29.21 JP7.6
  Top 0.406: JP7.6 92.71,29.21 91.44,30.48 91.44,35.56 90.81,36.2 ZD1.5
N$3
  Top 0.254: U$2.10 8.01,89.28 8.89,90.17 8.89,90.59 C1.1
N$4  (via drill 0.3)
  Top 0.254: C2.1 v11.75,81.92 | v11.75,85.09 10.25,85.09 U$2.1
  Bottom 0.254: v11.75,81.92 v11.75,85.09
N$5
  Top 0.305: R2.1 20.54,55.24 21.59,55.24 22.23,54.61 IC2.7
  Top 0.406: IC2.7 25.4,54.61 27.94,52.07 31.75,52.07 JP2.2
N$6
  Top 0.305: JP7.5 95.25,31.11 92.71,31.11 92.71,37.15 92.71,38.1 93.98,39.37 JP7.2
  Top 0.406: ZD1.6 92.39,37.47 92.71,37.15
N$7
  Top 0.406: IC5.1 81.35,51.81 L1.P$2 C5.2
N$8
  Top 0.406: D1.A C5.1 77.8,52.47 L2.P$1
N$9  (1 unrouted)
  Top 0.406: C7.2 R3.2 74.93,48.26 73.03,50.16 73.03,51.75 72.39,52.39 71.77,52.39 C6.2 D1.K
N$10
  Top 0.406: IC1.2 84.14,35.56 84.77,36.2 84.77,36.83 85.41,37.47 ZD1.1
N$16
  Top 0.406: IC5.3 78.6,49.86 R1.2 R3.1 C7.1
P3V3  (11 unrouted)
  Top 0.254: C3.1 4.66,87.21 5.08,87.63 6.26,87.63 U$2.13
  Top 0.305: R2.2 20.74,53.34 IC2.8
  Top 0.406: PCB1.1 55.24,63.18 55.24,71.12 56.2,72.07 JP3.1
  Bottom 0.254: SV2.1 75.56,4.45 75.56,12.06 SV5.1
P5V  (2 unrouted)
  Top 0.406: PCB1.4 53.98,64.68 JP3.4 | PCB1.2 56.52,64.68 JP3.2
PBAT  (1 unrouted)
  Top 0.406: L1.P$1 83.77,54.59 IC5.5 IC5.4 83.77,47.98 C4.2
RPI_1WIRE
  Top 0.406: JP3.7 48.58,72.07 47.62,71.12 47.62,63.18 PCB1.7 48.78,60.21 43.18,54.61 IC4.2
RPI_MISO  (via drill 0.3)  (1 unrouted)
  Top 0.254: SV3.7 62.23,4.45 62.23,6.03 62.87,6.67 63.5,6.67 65.09,8.26 v83.19,8.26
  Top 0.406: PCB1.21 29.84,63.18 29.84,71.12 30.8,72.07 JP3.21
  Bottom 0.254: SV2.7 83.19,4.45 v83.19,8.26 83.19,12.06 SV5.7
RPI_MOSI  (via drill 0.3)  (1 unrouted)
  Top 0.254: v81.92,11.43 83.19,12.7 83.19,14.61 SV5.8 | v81.92,8.89 64.77,8.89 63.18,7.3 62.55,7.3 SV3.8
  Top 0.406: PCB1.19 32.38,63.18 32.38,71.12 33.34,72.07 JP3.19
  Bottom 0.254: SV2.8 v81.92,8.89 v81.92,11.43
RPI_RX  (via drill 0.3)  (1 unrouted)
  Top 0.254: SV3.3 57.15,4.45 57.15,6.03 58.1,6.99 59.05,6.99 61.28,9.21 61.91,9.21 63.5,10.79 v78.11,10.79
  Top 0.406: JP3.10 46.35,64.68 PCB1.10
  Bottom 0.254: SV2.3 78.11,4.45 v78.11,10.79 78.11,11.75 76.83,13.02 SV5.3
RPI_SCK  (via drill 0.3)  (1 unrouted)
  Top 0.254: SV3.9 67.31,6.99 v85.72,6.99
  Top 0.406: PCB1.23 27.3,63.18 27.3,71.12 28.26,72.07 JP3.23
  Bottom 0.254: SV2.9 85.72,4.45 v85.72,6.99 85.72,7.62 85.72,12.06 SV5.9
RPI_SCL  (via drill 0.3)  (3 unrouted)
  Top 0.254: SV3.5 59.69,4.45 59.69,6.03 61.59,7.94 62.87,7.94 64.45,9.53 v80.64,9.53 | U$2.23 9.01,83.7 9.53,83.19 14.61,83.19 JP5.3 16.51,82.55 17.78,81.28 17.78,78.42 19.37,76.83 33.34,76.83 35.72,74.45 35.88,74.3 36.2,73.98 49.85,73.98 51.44,72.39 JP3.5
  Top 0.406: PCB1.5 54.61,58.73 U1.6
  Bottom 0.254: SV2.5 80.64,4.45 v80.64,9.53 80.64,12.06 SV5.5
RPI_SDA  (via drill 0.3)  (2 unrouted)
  Top 0.254: v79.38,11.43 80.64,12.7 80.64,14.61 SV5.6 78.74,16.51 | v79.38,10.16 63.82,10.16 62.23,8.57 61.28,8.57 SV3.6 | U$2.24 9.6,84.39 10.16,83.82 13.97,83.82 JP5.4 16.51,85.09 18.41,83.19 18.41,78.74 19.68,77.47 33.66,77.47 36.51,74.61 52.07,74.61 53.98,72.71 JP3.3
  Top 0.406: JP3.3 53.66,72.07 52.7,71.12 52.7,63.18 PCB1.3 55.88,60.01 U1.5
  Bottom 0.254: SV2.6 v79.38,10.16 v79.38,11.43
RPI_TX  (via drill 0.3)  (1 unrouted)
  Top 0.254: SV5.4 78.11,14.61 78.11,12.7 v76.83,11.43 63.18,11.43 61.59,9.84 60.96,9.84 58.74,7.62 57.78,7.62 SV3.4
  Top 0.406: JP3.8 48.9,64.68 PCB1.8
  Bottom 0.254: SV2.4 v76.83,11.43
SSEL  (via drill 0.3)  (1 unrouted)
  Top 0.254: SV5.10 85.72,14.61 85.72,12.7 v84.45,11.43 84.45,11.11 | SV3.10 65.41,7.62 v84.45,7.62
  Top 0.406: JP3.26 26.04,64.68 PCB1.26
  Bottom 0.254: SV2.10 v84.45,7.62 84.45,8.89 v84.45,11.43
TARGET_USB_N  (1 unrouted)
TARGET_USB_P  (1 unrouted)
VDDCORE  (1 unrouted)
X1
  Top 0.406: U$1.P$2 52.07,48.38 U1.1
X2
  Top 0.406: U$1.P$1 53.34,50.16 U1.2
ZUEND_KFZ
  Top 0.61: JP4.6 JP4.5
  Top 0.813: 32.32,81.72 32.32,83.12 34.61,85.41 42.23,85.41 43.18,84.45 90.81,84.45 92.71,82.55 JP4.5
ZUENDPLUS_LED2
  Top 0.406: PCB1.15 37.47,63.18 37.47,71.12 38.42,72.07 JP3.15

### Text on the board
tDocu: GYRO | POWER | ID EEPROM | V | 1WIRE | D | G | BUTTONS